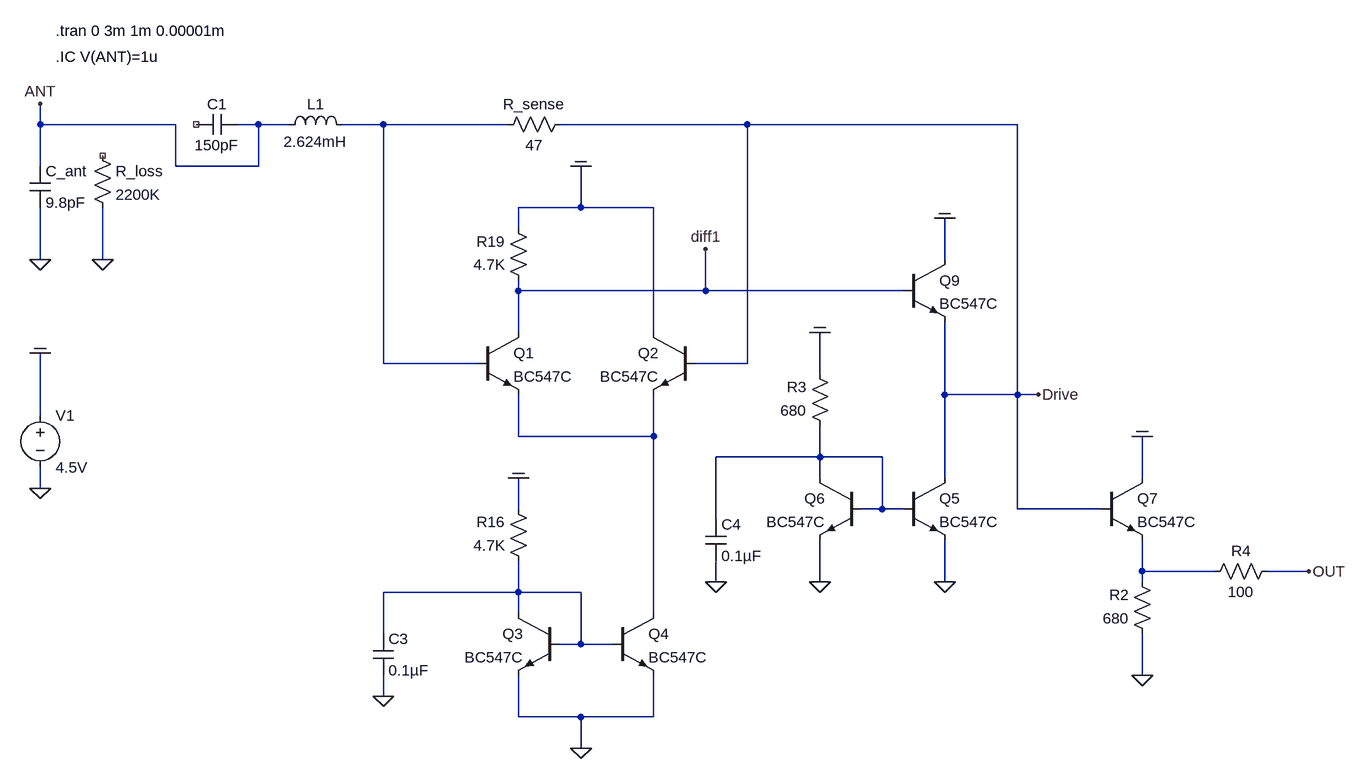
[diagram p0: schematic 2020_current_sense_comparator_npn_v05.asc]
2020_current_sense_comparator_npn_v05.asc, the LTspice schematic file:
Version 4
SHEET 1 3920 3748
WIRE -832 480 -832 448
WIRE -624 480 -832 480
WIRE -496 480 -528 480
WIRE -448 480 -496 480
WIRE -304 480 -368 480
WIRE -112 480 -304 480
WIRE 256 480 -32 480
WIRE 672 480 256 480
WIRE -832 544 -832 480
WIRE -624 544 -624 480
WIRE -496 544 -496 480
WIRE -496 544 -624 544
WIRE 0 608 0 544
WIRE 0 608 -96 608
WIRE 112 608 0 608
WIRE -96 640 -96 608
WIRE -832 688 -832 608
WIRE -736 688 -736 608
WIRE 560 688 560 624
WIRE -96 736 -96 720
WIRE 192 736 192 672
WIRE 192 736 -96 736
WIRE 496 736 192 736
WIRE -96 800 -96 736
WIRE 112 800 112 608
WIRE -304 848 -304 480
WIRE -160 848 -304 848
WIRE 256 848 256 480
WIRE 256 848 176 848
WIRE 368 864 368 800
WIRE 560 896 560 784
WIRE 672 896 672 480
WIRE 672 896 560 896
WIRE 704 896 672 896
WIRE -832 928 -832 832
WIRE -96 960 -96 896
WIRE 112 960 112 896
WIRE 112 960 -96 960
WIRE 368 992 368 944
WIRE 368 992 208 992
WIRE 464 992 368 992
WIRE 368 1024 368 992
WIRE 560 1024 560 896
WIRE 864 1024 864 960
WIRE -832 1040 -832 1008
WIRE -96 1072 -96 1024
WIRE 464 1072 464 992
WIRE 464 1072 432 1072
WIRE 496 1072 464 1072
WIRE 672 1072 672 896
WIRE 800 1072 672 1072
WIRE 208 1088 208 992
WIRE 864 1168 864 1120
WIRE 976 1168 864 1168
WIRE 1120 1168 1056 1168
WIRE 208 1184 208 1152
WIRE 368 1184 368 1120
WIRE 560 1184 560 1120
WIRE 864 1184 864 1168
WIRE -96 1200 -96 1152
WIRE -96 1200 -304 1200
WIRE 0 1200 -96 1200
WIRE -96 1232 -96 1200
WIRE 112 1232 112 960
WIRE -304 1264 -304 1200
WIRE 0 1280 0 1200
WIRE 0 1280 -32 1280
WIRE 48 1280 0 1280
WIRE 864 1328 864 1264
WIRE -304 1360 -304 1328
WIRE -96 1392 -96 1328
WIRE 0 1392 -96 1392
WIRE 112 1392 112 1328
WIRE 112 1392 0 1392
WIRE 0 1440 0 1392
FLAG -832 1040 0
FLAG -832 832 COM
FLAG -832 688 0
FLAG -832 448 ANT
FLAG -736 688 0
FLAG 0 1440 0
FLAG 0 544 COM
FLAG -96 1024 COM
FLAG 560 624 COM
FLAG 704 896 Drive
FLAG 192 672 diff1
FLAG 560 1184 0
FLAG 368 800 COM
FLAG 368 1184 0
FLAG 864 1328 0
FLAG 1120 1168 OUT
FLAG 864 960 COM
FLAG -304 1360 0
FLAG 208 1184 0
SYMBOL voltage -832 912 R0
WINDOW 123 0 0 Left 0
WINDOW 39 0 0 Left 0
SYMATTR InstName V1
SYMATTR Value 4.5V
SYMBOL ind -464 496 R270
WINDOW 0 32 56 VTop 2
WINDOW 3 5 56 VBottom 2
SYMATTR InstName L1
SYMATTR Value 2.624mH
SYMATTR SpiceLine Rser=66 Cpar=1.216pF
SYMBOL cap -848 544 R0
SYMATTR InstName C_ant
SYMATTR Value 9.8pF
SYMBOL res -752 512 R0
SYMATTR InstName R_loss
SYMATTR Value 2200K
SYMBOL res -16 464 R90
WINDOW 0 0 56 VBottom 2
WINDOW 3 32 56 VTop 2
SYMATTR InstName R_sense
SYMATTR Value 47
SYMBOL npn -160 800 R0
SYMATTR InstName Q1
SYMATTR Value BC547C
SYMBOL npn 176 800 M0
SYMATTR InstName Q2
SYMATTR Value BC547C
SYMBOL npn -32 1232 M0
SYMATTR InstName Q3
SYMATTR Value BC547C
SYMBOL npn 48 1232 R0
SYMATTR InstName Q4
SYMATTR Value BC547C
SYMBOL res -80 1168 R180
WINDOW 0 36 76 Left 2
WINDOW 3 36 40 Left 2
SYMATTR InstName R16
SYMATTR Value 4.7K
SYMBOL res -80 736 R180
WINDOW 0 36 76 Left 2
WINDOW 3 36 40 Left 2
SYMATTR InstName R19
SYMATTR Value 4.7K
SYMBOL npn 496 688 R0
SYMATTR InstName Q9
SYMATTR Value BC547C
SYMBOL npn 496 1024 R0
SYMATTR InstName Q5
SYMATTR Value BC547C
SYMBOL cap -528 464 R90
WINDOW 0 0 32 VBottom 2
WINDOW 3 32 32 VTop 2
SYMATTR InstName C1
SYMATTR Value 150pF
SYMBOL npn 432 1024 M0
SYMATTR InstName Q6
SYMATTR Value BC547C
SYMBOL res 384 960 R180
WINDOW 0 36 76 Left 2
WINDOW 3 36 40 Left 2
SYMATTR InstName R3
SYMATTR Value 680
SYMBOL npn 800 1024 R0
SYMATTR InstName Q7
SYMATTR Value BC547C
SYMBOL res 880 1280 R180
WINDOW 0 36 76 Left 2
WINDOW 3 36 40 Left 2
SYMATTR InstName R2
SYMATTR Value 680
SYMBOL res 960 1184 R270
WINDOW 0 32 56 VTop 2
WINDOW 3 0 56 VBottom 2
SYMATTR InstName R4
SYMATTR Value 100
SYMBOL cap -320 1264 R0
SYMATTR InstName C3
SYMATTR Value 0.1µF
SYMBOL cap 192 1088 R0
SYMATTR InstName C4
SYMATTR Value 0.1µF
TEXT -808 336 Left 2 !.tran 0 3m 1m 0.00001m
TEXT -808 376 Left 2 !.IC V(ANT)=1u

The netlist it stands for:
* 2020_current_sense_comparator_npn_v05.asc
V1 COM 0 4.5V
L1 ANT N001 2.624mH Rser=66 Cpar=1.216pF
C_ant ANT 0 9.8pF
R_loss NC_01 0 2200K
R_sense Drive N001 47
Q1 diff1 N001 N002 0 BC547C
Q2 COM Drive N002 0 BC547C
Q3 N005 N005 0 0 BC547C
Q4 N002 N005 0 0 BC547C
R16 N005 COM 4.7K
R19 diff1 COM 4.7K
Q9 COM diff1 Drive 0 BC547C
Q5 Drive N003 0 0 BC547C
C1 ANT NC_02 150pF
Q6 N003 N003 0 0 BC547C
R3 N003 COM 680
Q7 COM Drive N004 0 BC547C
R2 0 N004 680
R4 N004 OUT 100
C3 N005 0 0.1µF
C4 N003 0 0.1µF
.model NPN NPN
.model PNP PNP
.lib standard.bjt
.tran 0 3m 1m 0.00001m
.IC V(ANT)=1u
.backanno
.end